# EAGLE design Clock (EAGLE 7.2.0)
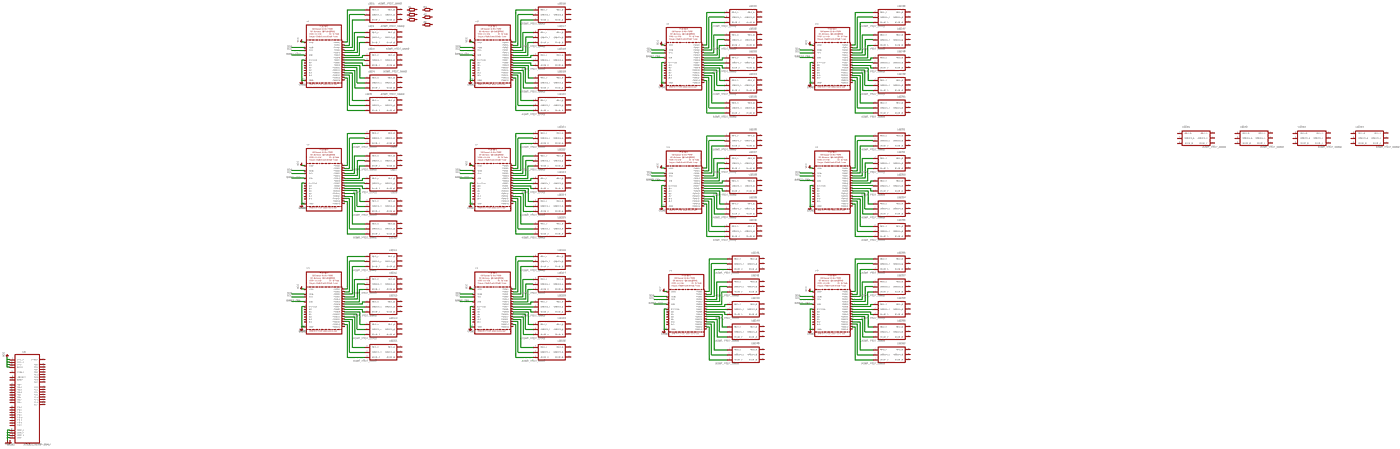
[diagram p0: schematic, sheet 1, overview]
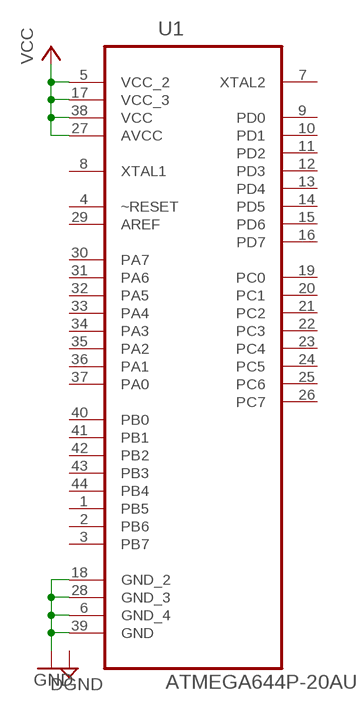
[diagram p1: schematic, sheet 1, part 1 of 4]
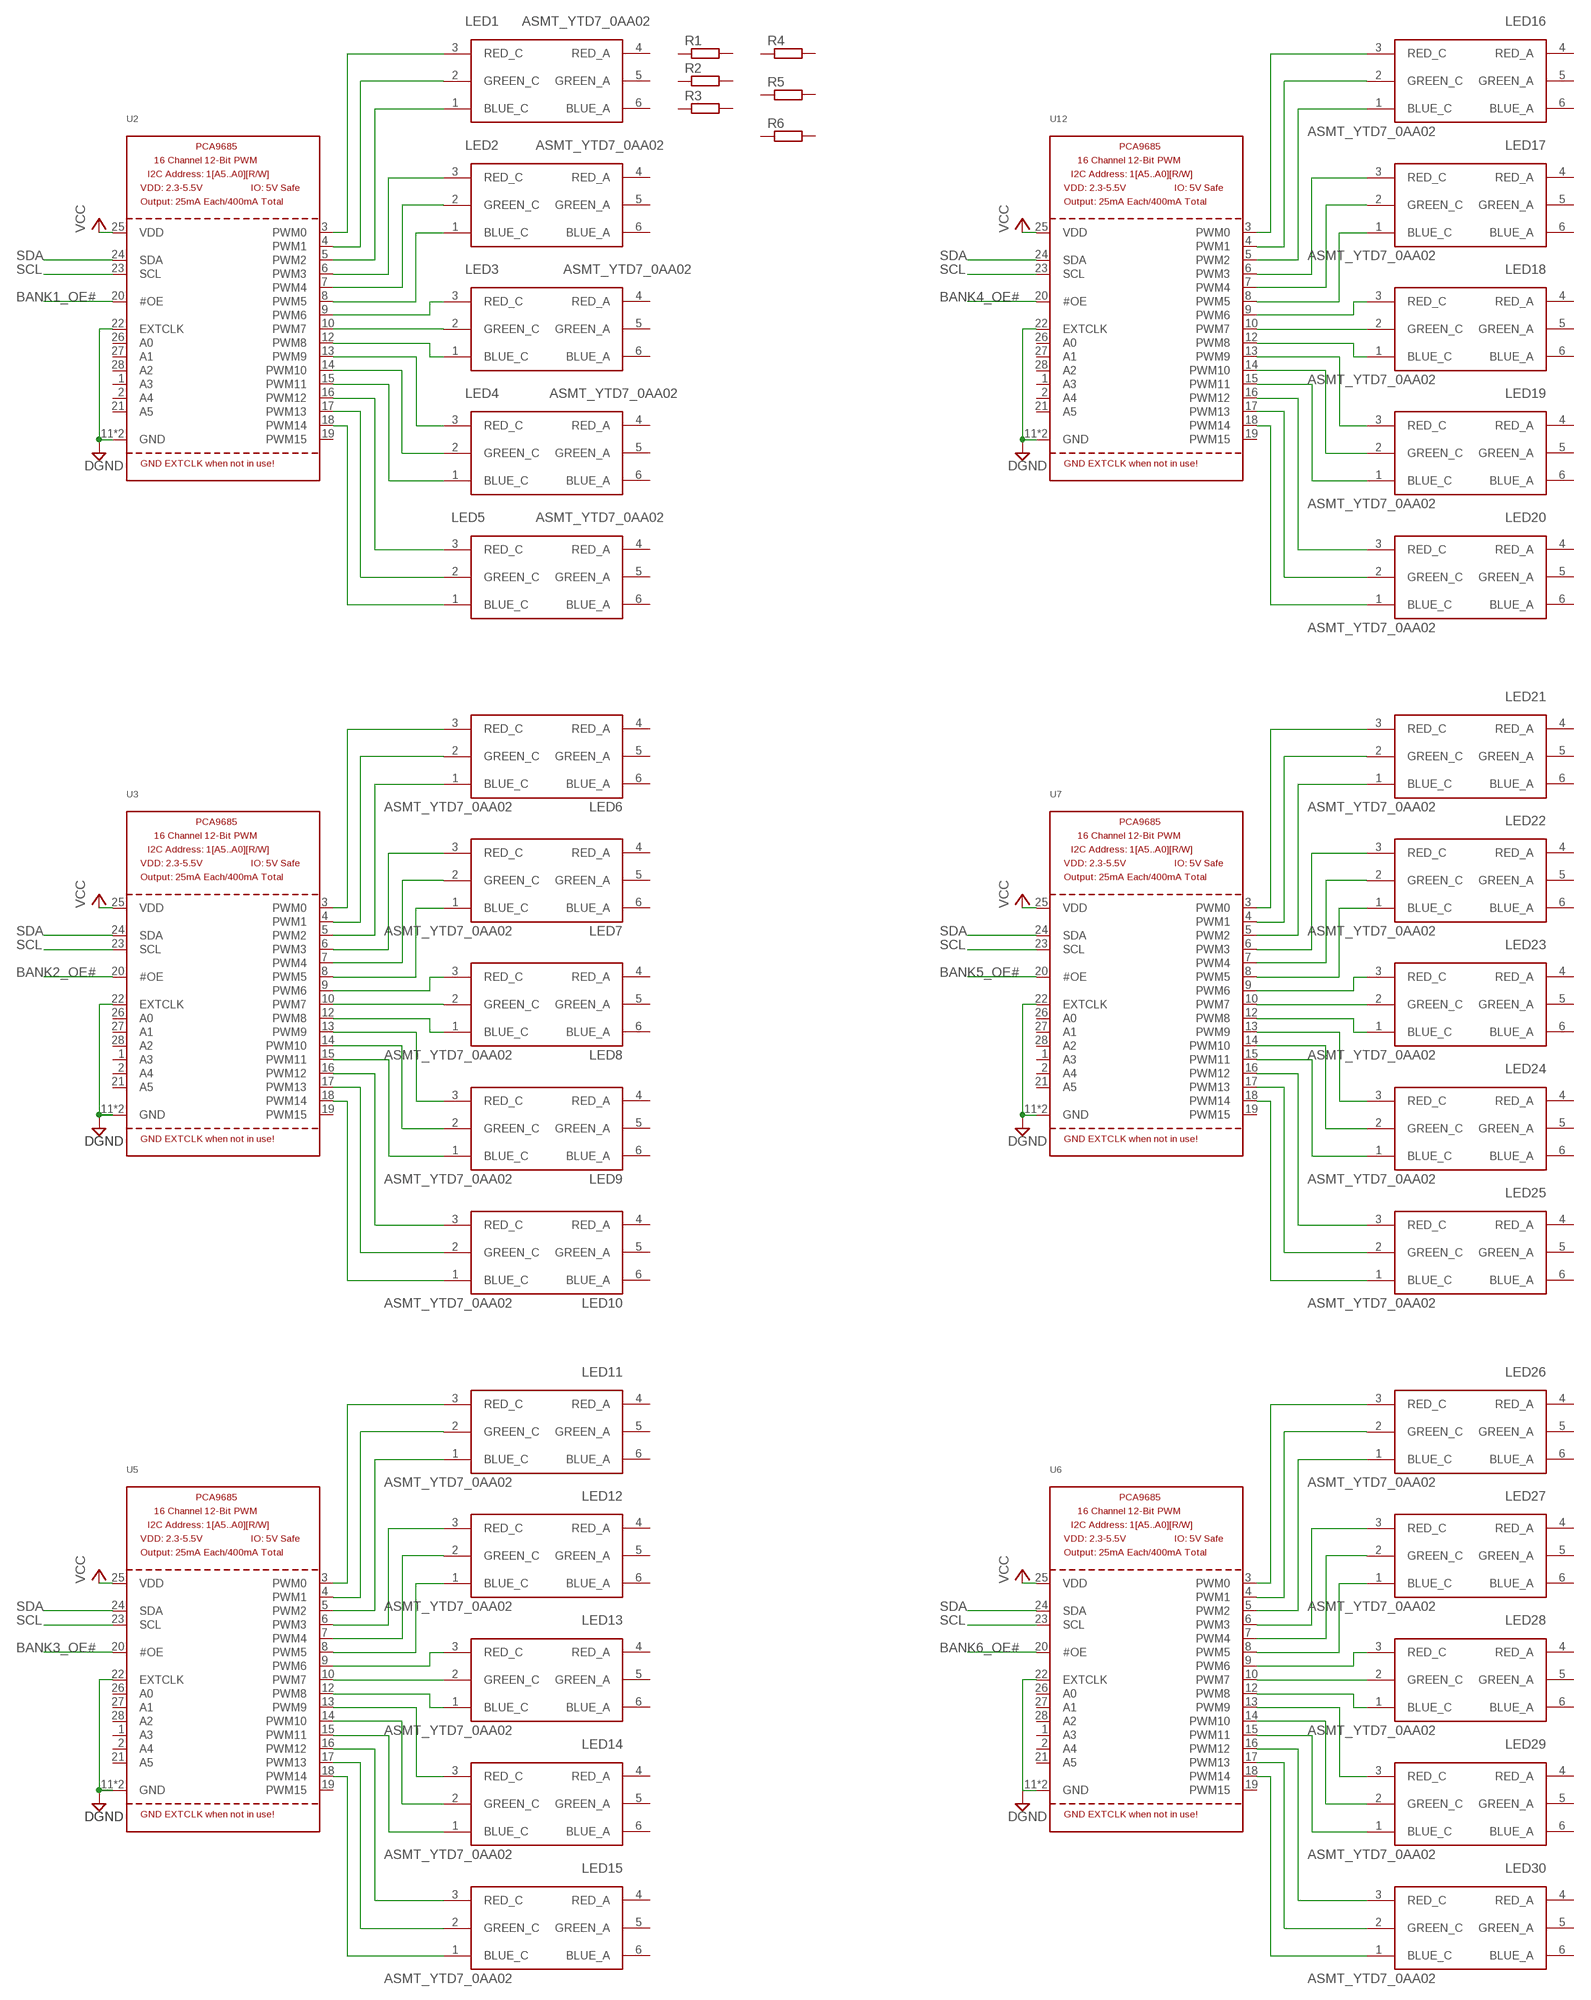
[diagram p2: schematic, sheet 1, part 2 of 4]
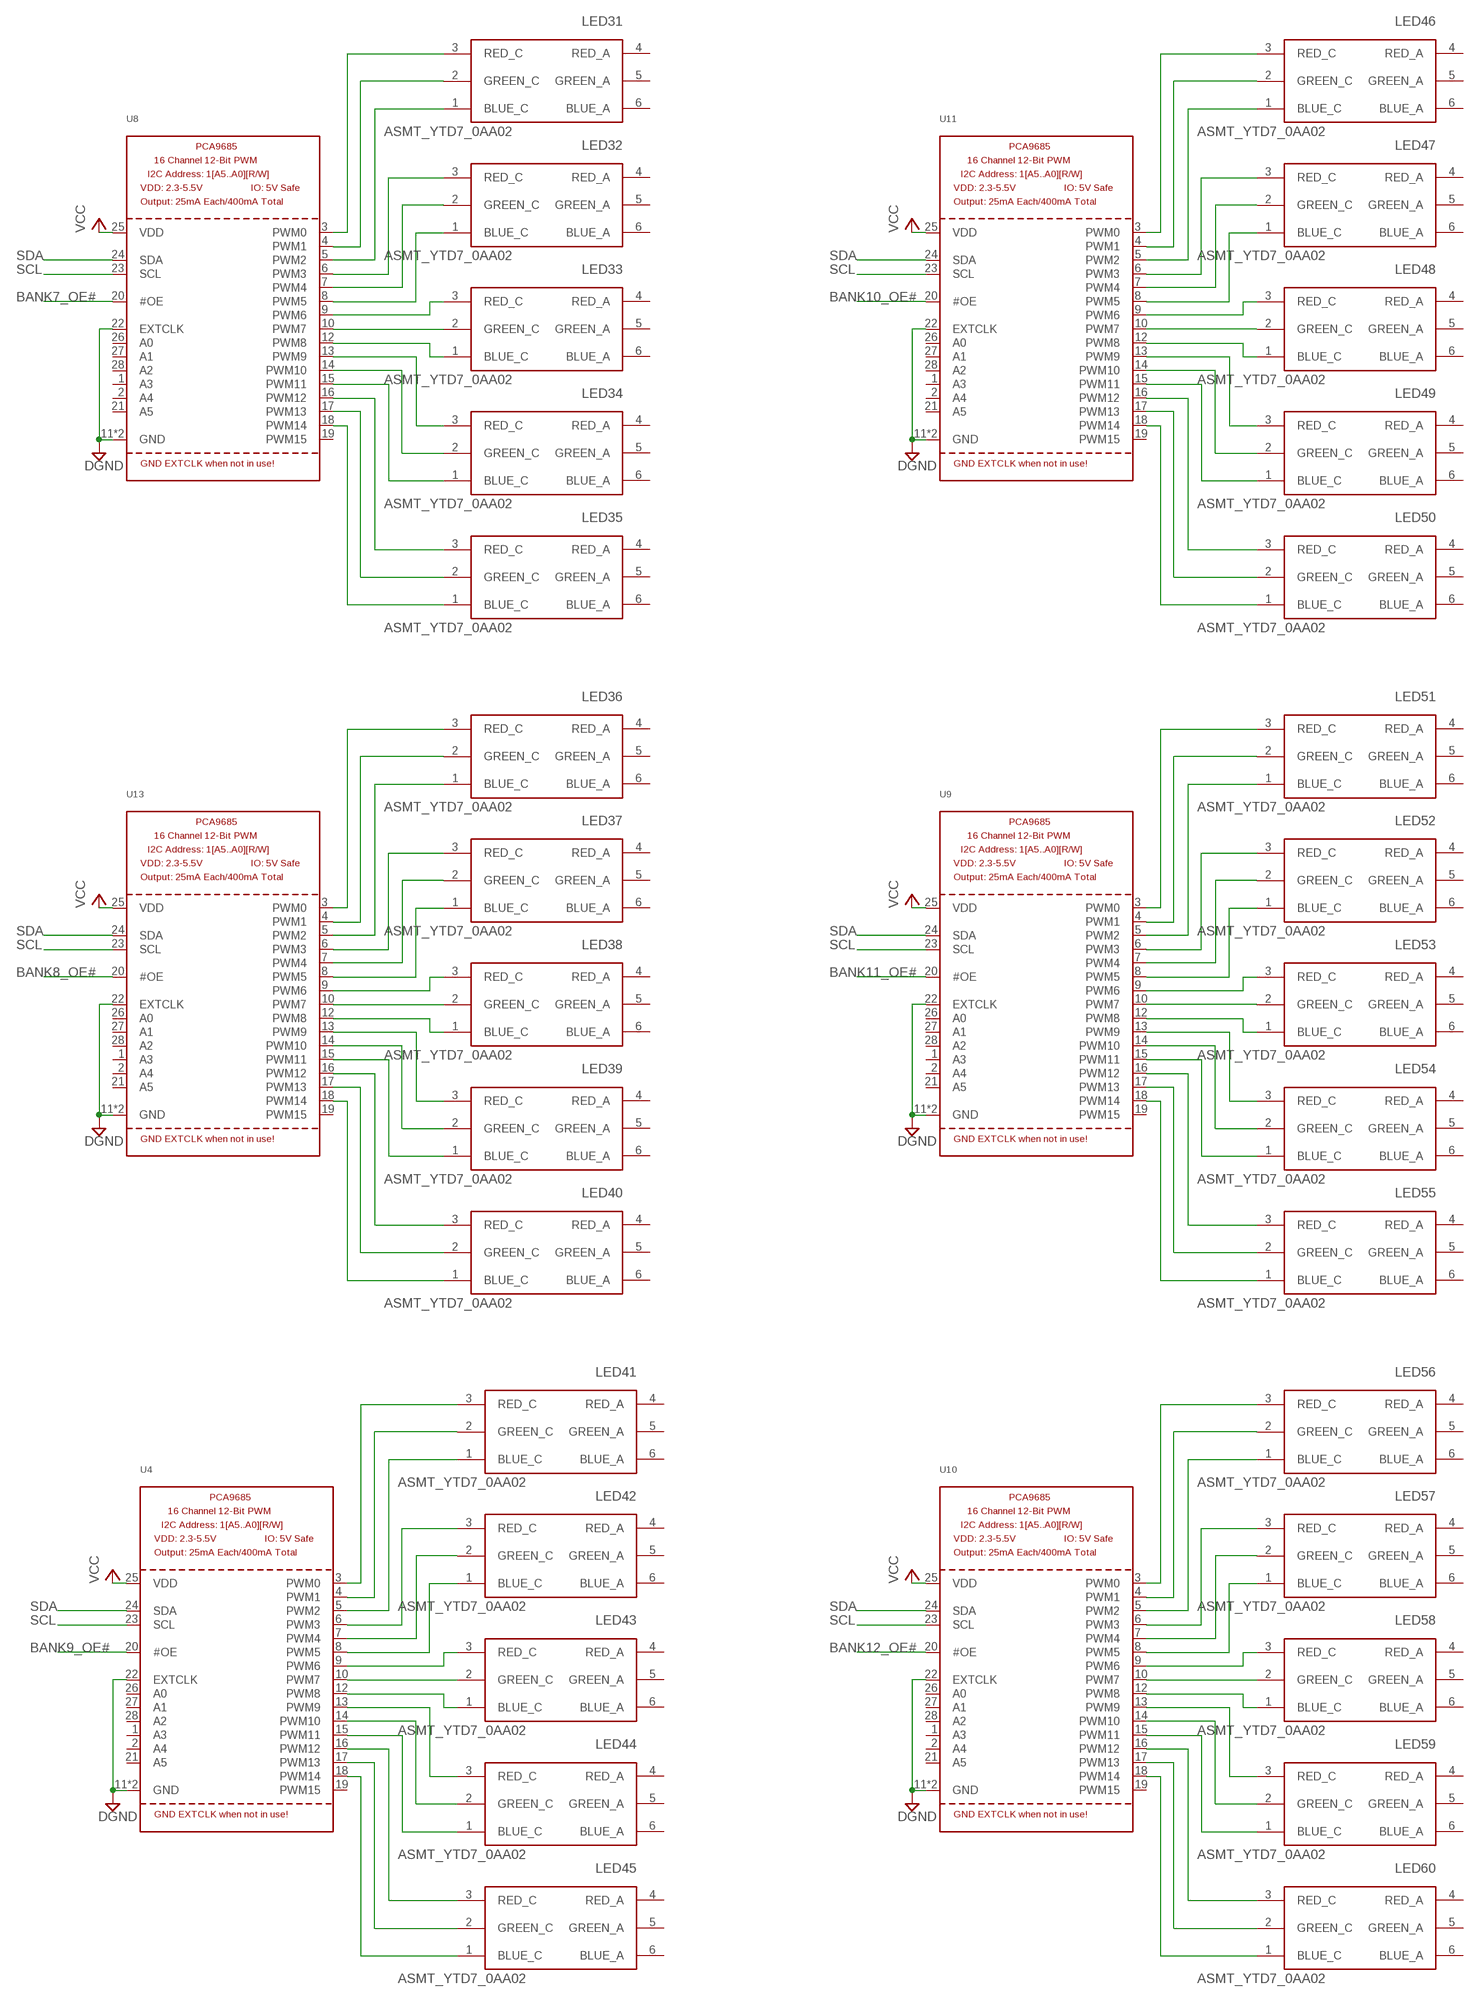
[diagram p3: schematic, sheet 1, part 3 of 4]
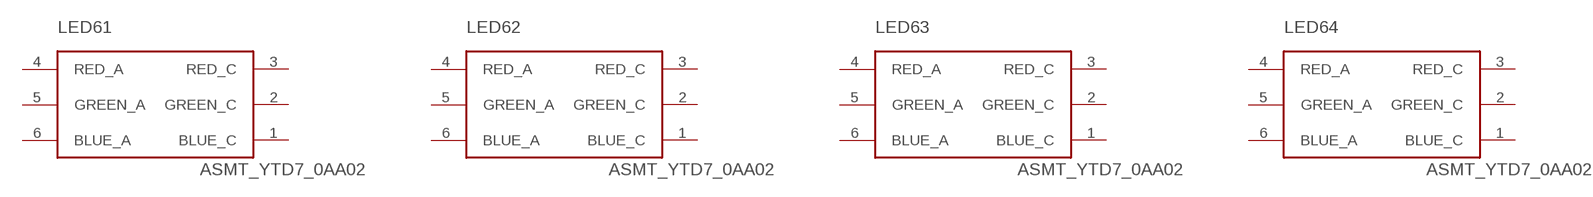
[diagram p4: schematic, sheet 1, part 4 of 4]

## Parts
LED1  ASMT_YTD7_0AA02  [ASMT-YTD7-0AA02]
LED2  ASMT_YTD7_0AA02  [ASMT-YTD7-0AA02]
LED3  ASMT_YTD7_0AA02  [ASMT-YTD7-0AA02]
LED4  ASMT_YTD7_0AA02  [ASMT-YTD7-0AA02]
LED5  ASMT_YTD7_0AA02  [ASMT-YTD7-0AA02]
LED6  ASMT_YTD7_0AA02  [ASMT-YTD7-0AA02]
LED7  ASMT_YTD7_0AA02  [ASMT-YTD7-0AA02]
LED8  ASMT_YTD7_0AA02  [ASMT-YTD7-0AA02]
LED9  ASMT_YTD7_0AA02  [ASMT-YTD7-0AA02]
LED10  ASMT_YTD7_0AA02  [ASMT-YTD7-0AA02]
LED11  ASMT_YTD7_0AA02  [ASMT-YTD7-0AA02]
LED12  ASMT_YTD7_0AA02  [ASMT-YTD7-0AA02]
LED13  ASMT_YTD7_0AA02  [ASMT-YTD7-0AA02]
LED14  ASMT_YTD7_0AA02  [ASMT-YTD7-0AA02]
LED15  ASMT_YTD7_0AA02  [ASMT-YTD7-0AA02]
LED16  ASMT_YTD7_0AA02  [ASMT-YTD7-0AA02]
LED17  ASMT_YTD7_0AA02  [ASMT-YTD7-0AA02]
LED18  ASMT_YTD7_0AA02  [ASMT-YTD7-0AA02]
LED19  ASMT_YTD7_0AA02  [ASMT-YTD7-0AA02]
LED20  ASMT_YTD7_0AA02  [ASMT-YTD7-0AA02]
LED21  ASMT_YTD7_0AA02  [ASMT-YTD7-0AA02]
LED22  ASMT_YTD7_0AA02  [ASMT-YTD7-0AA02]
LED23  ASMT_YTD7_0AA02  [ASMT-YTD7-0AA02]
LED24  ASMT_YTD7_0AA02  [ASMT-YTD7-0AA02]
LED25  ASMT_YTD7_0AA02  [ASMT-YTD7-0AA02]
LED26  ASMT_YTD7_0AA02  [ASMT-YTD7-0AA02]
LED27  ASMT_YTD7_0AA02  [ASMT-YTD7-0AA02]
LED28  ASMT_YTD7_0AA02  [ASMT-YTD7-0AA02]
LED29  ASMT_YTD7_0AA02  [ASMT-YTD7-0AA02]
LED30  ASMT_YTD7_0AA02  [ASMT-YTD7-0AA02]
LED31  ASMT_YTD7_0AA02  [ASMT-YTD7-0AA02]
LED32  ASMT_YTD7_0AA02  [ASMT-YTD7-0AA02]
LED33  ASMT_YTD7_0AA02  [ASMT-YTD7-0AA02]
LED34  ASMT_YTD7_0AA02  [ASMT-YTD7-0AA02]
LED35  ASMT_YTD7_0AA02  [ASMT-YTD7-0AA02]
LED36  ASMT_YTD7_0AA02  [ASMT-YTD7-0AA02]
LED37  ASMT_YTD7_0AA02  [ASMT-YTD7-0AA02]
LED38  ASMT_YTD7_0AA02  [ASMT-YTD7-0AA02]
LED39  ASMT_YTD7_0AA02  [ASMT-YTD7-0AA02]
LED40  ASMT_YTD7_0AA02  [ASMT-YTD7-0AA02]
LED41  ASMT_YTD7_0AA02  [ASMT-YTD7-0AA02]
LED42  ASMT_YTD7_0AA02  [ASMT-YTD7-0AA02]
LED43  ASMT_YTD7_0AA02  [ASMT-YTD7-0AA02]
LED44  ASMT_YTD7_0AA02  [ASMT-YTD7-0AA02]
LED45  ASMT_YTD7_0AA02  [ASMT-YTD7-0AA02]
LED46  ASMT_YTD7_0AA02  [ASMT-YTD7-0AA02]
LED47  ASMT_YTD7_0AA02  [ASMT-YTD7-0AA02]
LED48  ASMT_YTD7_0AA02  [ASMT-YTD7-0AA02]
LED49  ASMT_YTD7_0AA02  [ASMT-YTD7-0AA02]
LED50  ASMT_YTD7_0AA02  [ASMT-YTD7-0AA02]
LED51  ASMT_YTD7_0AA02  [ASMT-YTD7-0AA02]
LED52  ASMT_YTD7_0AA02  [ASMT-YTD7-0AA02]
LED53  ASMT_YTD7_0AA02  [ASMT-YTD7-0AA02]
LED54  ASMT_YTD7_0AA02  [ASMT-YTD7-0AA02]
LED55  ASMT_YTD7_0AA02  [ASMT-YTD7-0AA02]
LED56  ASMT_YTD7_0AA02  [ASMT-YTD7-0AA02]
LED57  ASMT_YTD7_0AA02  [ASMT-YTD7-0AA02]
LED58  ASMT_YTD7_0AA02  [ASMT-YTD7-0AA02]
LED59  ASMT_YTD7_0AA02  [ASMT-YTD7-0AA02]
LED60  ASMT_YTD7_0AA02  [ASMT-YTD7-0AA02]
LED61  ASMT_YTD7_0AA02  [ASMT-YTD7-0AA02]
LED62  ASMT_YTD7_0AA02  [ASMT-YTD7-0AA02]
LED63  ASMT_YTD7_0AA02  [ASMT-YTD7-0AA02]
LED64  ASMT_YTD7_0AA02  [ASMT-YTD7-0AA02]
R1  R0603  [R0603]
R2  R0603  [R0603]
R3  R0603  [R0603]
R4  R-EU_R0402  [R0402]
R5  R-EU_R0402  [R0402]
R6  R-EU_R0402  [R0402]
U1  ATMEGA644P-20AU  [QFP80P1200X1200X120-44N]
U2  PCA9685QFN28  [QFN28]
U3  PCA9685QFN28  [QFN28]
U4  PCA9685QFN28  [QFN28]
U5  PCA9685QFN28  [QFN28]
U6  PCA9685QFN28  [QFN28]
U7  PCA9685QFN28  [QFN28]
U8  PCA9685QFN28  [QFN28]
U9  PCA9685QFN28  [QFN28]
U10  PCA9685QFN28  [QFN28]
U11  PCA9685QFN28  [QFN28]
U12  PCA9685QFN28  [QFN28]
U13  PCA9685QFN28  [QFN28]

## Nets
BANK1_OE#: U2.20(#OE)
BANK2_OE#: U3.20(#OE)
BANK3_OE#: U5.20(#OE)
BANK4_OE#: U12.20(#OE)
BANK5_OE#: U7.20(#OE)
BANK6_OE#: U6.20(#OE)
BANK7_OE#: U8.20(#OE)
BANK8_OE#: U13.20(#OE)
BANK9_OE#: U4.20(#OE)
BANK10_OE#: U11.20(#OE)
BANK11_OE#: U9.20(#OE)
BANK12_OE#: U10.20(#OE)
DGND: U2.11(GND) U2.22(EXTCLK) U2.M(GND) U3.11(GND) U3.22(EXTCLK) U3.M(GND) U4.11(GND) U4.22(EXTCLK) U4.M(GND) U5.11(GND) U5.22(EXTCLK) U5.M(GND) U6.11(GND) U6.M(GND) U7.11(GND) U7.22(EXTCLK) U7.M(GND) U8.11(GND) U8.22(EXTCLK) U8.M(GND) U9.11(GND) U9.22(EXTCLK) U9.M(GND) U10.11(GND) U10.22(EXTCLK) U10.M(GND) U11.11(GND) U11.22(EXTCLK) U11.M(GND) U12.11(GND) U12.22(EXTCLK) U12.M(GND) U13.11(GND) U13.22(EXTCLK) U13.M(GND)
GND: U1.6(GND_4) U1.18(GND_2) U1.28(GND_3) U1.39(GND)
N$2: LED8.3(RED_C) U3.9(PWM6)
N$6: LED3.3(RED_C) U2.9(PWM6)
N$7: LED3.1(BLUE_C) U2.12(PWM8)
N$8: LED2.1(BLUE_C) U2.8(PWM5)
N$9: LED2.2(GREEN_C) U2.7(PWM4)
N$10: LED2.3(RED_C) U2.6(PWM3)
N$11: LED1.1(BLUE_C) U2.5(PWM2)
N$12: LED1.2(GREEN_C) U2.4(PWM1)
N$13: LED1.3(RED_C) U2.3(PWM0)
N$14: LED4.3(RED_C) U2.13(PWM9)
N$15: LED4.2(GREEN_C) U2.14(PWM10)
N$16: LED4.1(BLUE_C) U2.15(PWM11)
N$17: LED5.3(RED_C) U2.16(PWM12)
N$18: LED5.2(GREEN_C) U2.17(PWM13)
N$19: LED5.1(BLUE_C) U2.18(PWM14)
N$20: LED3.2(GREEN_C) U2.10(PWM7)
N$21: LED8.1(BLUE_C) U3.12(PWM8)
N$22: LED7.1(BLUE_C) U3.8(PWM5)
N$23: LED7.2(GREEN_C) U3.7(PWM4)
N$24: LED7.3(RED_C) U3.6(PWM3)
N$25: LED6.1(BLUE_C) U3.5(PWM2)
N$26: LED6.2(GREEN_C) U3.4(PWM1)
N$27: LED6.3(RED_C) U3.3(PWM0)
N$28: LED9.3(RED_C) U3.13(PWM9)
N$29: LED9.2(GREEN_C) U3.14(PWM10)
N$30: LED9.1(BLUE_C) U3.15(PWM11)
N$31: LED10.3(RED_C) U3.16(PWM12)
N$32: LED10.2(GREEN_C) U3.17(PWM13)
N$33: LED10.1(BLUE_C) U3.18(PWM14)
N$34: LED13.3(RED_C) U5.9(PWM6)
N$35: LED13.1(BLUE_C) U5.12(PWM8)
N$36: LED12.1(BLUE_C) U5.8(PWM5)
N$37: LED12.2(GREEN_C) U5.7(PWM4)
N$38: LED12.3(RED_C) U5.6(PWM3)
N$39: LED11.1(BLUE_C) U5.5(PWM2)
N$40: LED11.2(GREEN_C) U5.4(PWM1)
N$41: LED11.3(RED_C) U5.3(PWM0)
N$42: LED14.3(RED_C) U5.13(PWM9)
N$43: LED14.2(GREEN_C) U5.14(PWM10)
N$44: LED14.1(BLUE_C) U5.15(PWM11)
N$45: LED15.3(RED_C) U5.16(PWM12)
N$46: LED15.2(GREEN_C) U5.17(PWM13)
N$47: LED15.1(BLUE_C) U5.18(PWM14)
N$48: LED18.3(RED_C) U12.9(PWM6)
N$49: LED18.1(BLUE_C) U12.12(PWM8)
N$50: LED17.1(BLUE_C) U12.8(PWM5)
N$51: LED17.2(GREEN_C) U12.7(PWM4)
N$52: LED17.3(RED_C) U12.6(PWM3)
N$53: LED16.1(BLUE_C) U12.5(PWM2)
N$54: LED16.2(GREEN_C) U12.4(PWM1)
N$55: LED16.3(RED_C) U12.3(PWM0)
N$56: LED19.3(RED_C) U12.13(PWM9)
N$57: LED19.2(GREEN_C) U12.14(PWM10)
N$58: LED19.1(BLUE_C) U12.15(PWM11)
N$59: LED20.3(RED_C) U12.16(PWM12)
N$60: LED20.2(GREEN_C) U12.17(PWM13)
N$61: LED20.1(BLUE_C) U12.18(PWM14)
N$62: LED23.3(RED_C) U7.9(PWM6)
N$63: LED23.1(BLUE_C) U7.12(PWM8)
N$64: LED22.1(BLUE_C) U7.8(PWM5)
N$65: LED22.2(GREEN_C) U7.7(PWM4)
N$66: LED22.3(RED_C) U7.6(PWM3)
N$67: LED21.1(BLUE_C) U7.5(PWM2)
N$68: LED21.2(GREEN_C) U7.4(PWM1)
N$69: LED21.3(RED_C) U7.3(PWM0)
N$70: LED24.3(RED_C) U7.13(PWM9)
N$71: LED24.2(GREEN_C) U7.14(PWM10)
N$72: LED24.1(BLUE_C) U7.15(PWM11)
N$73: LED25.3(RED_C) U7.16(PWM12)
N$74: LED25.2(GREEN_C) U7.17(PWM13)
N$75: LED25.1(BLUE_C) U7.18(PWM14)
N$76: LED28.3(RED_C) U6.9(PWM6)
N$77: LED28.1(BLUE_C) U6.12(PWM8)
N$78: LED27.1(BLUE_C) U6.8(PWM5)
N$79: LED27.2(GREEN_C) U6.7(PWM4)
N$80: LED27.3(RED_C) U6.6(PWM3)
N$81: LED26.1(BLUE_C) U6.5(PWM2)
N$82: LED26.2(GREEN_C) U6.4(PWM1)
N$83: LED26.3(RED_C) U6.3(PWM0)
N$84: LED29.3(RED_C) U6.13(PWM9)
N$85: LED29.2(GREEN_C) U6.14(PWM10)
N$86: LED29.1(BLUE_C) U6.15(PWM11)
N$87: LED30.3(RED_C) U6.16(PWM12)
N$88: LED30.2(GREEN_C) U6.17(PWM13)
N$89: LED30.1(BLUE_C) U6.18(PWM14)
N$90: LED43.3(RED_C) U4.9(PWM6)
N$91: LED43.1(BLUE_C) U4.12(PWM8)
N$92: LED42.1(BLUE_C) U4.8(PWM5)
N$93: LED42.2(GREEN_C) U4.7(PWM4)
N$94: LED42.3(RED_C) U4.6(PWM3)
N$95: LED41.1(BLUE_C) U4.5(PWM2)
N$96: LED41.2(GREEN_C) U4.4(PWM1)
N$97: LED41.3(RED_C) U4.3(PWM0)
N$98: LED44.3(RED_C) U4.13(PWM9)
N$99: LED44.2(GREEN_C) U4.14(PWM10)
N$100: LED44.1(BLUE_C) U4.15(PWM11)
N$101: LED45.3(RED_C) U4.16(PWM12)
N$102: LED45.2(GREEN_C) U4.17(PWM13)
N$103: LED45.1(BLUE_C) U4.18(PWM14)
N$104: LED38.3(RED_C) U13.9(PWM6)
N$105: LED38.1(BLUE_C) U13.12(PWM8)
N$106: LED37.1(BLUE_C) U13.8(PWM5)
N$107: LED37.2(GREEN_C) U13.7(PWM4)
N$108: LED37.3(RED_C) U13.6(PWM3)
N$109: LED36.1(BLUE_C) U13.5(PWM2)
N$110: LED36.2(GREEN_C) U13.4(PWM1)
N$111: LED36.3(RED_C) U13.3(PWM0)
N$112: LED39.3(RED_C) U13.13(PWM9)
N$113: LED39.2(GREEN_C) U13.14(PWM10)
N$114: LED39.1(BLUE_C) U13.15(PWM11)
N$115: LED40.3(RED_C) U13.16(PWM12)
N$116: LED40.2(GREEN_C) U13.17(PWM13)
N$117: LED40.1(BLUE_C) U13.18(PWM14)
N$118: LED33.3(RED_C) U8.9(PWM6)
N$119: LED33.1(BLUE_C) U8.12(PWM8)
N$120: LED32.1(BLUE_C) U8.8(PWM5)
N$121: LED32.2(GREEN_C) U8.7(PWM4)
N$122: LED32.3(RED_C) U8.6(PWM3)
N$123: LED31.1(BLUE_C) U8.5(PWM2)
N$124: LED31.2(GREEN_C) U8.4(PWM1)
N$125: LED31.3(RED_C) U8.3(PWM0)
N$126: LED34.3(RED_C) U8.13(PWM9)
N$127: LED34.2(GREEN_C) U8.14(PWM10)
N$128: LED34.1(BLUE_C) U8.15(PWM11)
N$129: LED35.3(RED_C) U8.16(PWM12)
N$130: LED35.2(GREEN_C) U8.17(PWM13)
N$131: LED35.1(BLUE_C) U8.18(PWM14)
N$132: LED48.3(RED_C) U11.9(PWM6)
N$133: LED48.1(BLUE_C) U11.12(PWM8)
N$134: LED47.1(BLUE_C) U11.8(PWM5)
N$135: LED47.2(GREEN_C) U11.7(PWM4)
N$136: LED47.3(RED_C) U11.6(PWM3)
N$137: LED46.1(BLUE_C) U11.5(PWM2)
N$138: LED46.2(GREEN_C) U11.4(PWM1)
N$139: LED46.3(RED_C) U11.3(PWM0)
N$140: LED49.3(RED_C) U11.13(PWM9)
N$141: LED49.2(GREEN_C) U11.14(PWM10)
N$142: LED49.1(BLUE_C) U11.15(PWM11)
N$143: LED50.3(RED_C) U11.16(PWM12)
N$144: LED50.2(GREEN_C) U11.17(PWM13)
N$145: LED50.1(BLUE_C) U11.18(PWM14)
N$146: LED53.3(RED_C) U9.9(PWM6)
N$147: LED53.1(BLUE_C) U9.12(PWM8)
N$148: LED52.1(BLUE_C) U9.8(PWM5)
N$149: LED52.2(GREEN_C) U9.7(PWM4)
N$150: LED52.3(RED_C) U9.6(PWM3)
N$151: LED51.1(BLUE_C) U9.5(PWM2)
N$152: LED51.2(GREEN_C) U9.4(PWM1)
N$153: LED51.3(RED_C) U9.3(PWM0)
N$154: LED54.3(RED_C) U9.13(PWM9)
N$155: LED54.2(GREEN_C) U9.14(PWM10)
N$156: LED54.1(BLUE_C) U9.15(PWM11)
N$157: LED55.3(RED_C) U9.16(PWM12)
N$158: LED55.2(GREEN_C) U9.17(PWM13)
N$159: LED55.1(BLUE_C) U9.18(PWM14)
N$160: LED58.3(RED_C) U10.9(PWM6)
N$161: LED58.1(BLUE_C) U10.12(PWM8)
N$162: LED57.1(BLUE_C) U10.8(PWM5)
N$163: LED57.2(GREEN_C) U10.7(PWM4)
N$164: LED57.3(RED_C) U10.6(PWM3)
N$165: LED56.1(BLUE_C) U10.5(PWM2)
N$166: LED56.2(GREEN_C) U10.4(PWM1)
N$167: LED56.3(RED_C) U10.3(PWM0)
N$168: LED59.3(RED_C) U10.13(PWM9)
N$169: LED59.2(GREEN_C) U10.14(PWM10)
N$170: LED59.1(BLUE_C) U10.15(PWM11)
N$171: LED60.3(RED_C) U10.16(PWM12)
N$172: LED60.2(GREEN_C) U10.17(PWM13)
N$173: LED60.1(BLUE_C) U10.18(PWM14)
N$174: LED48.2(GREEN_C) U11.10(PWM7)
N$175: LED53.2(GREEN_C) U9.10(PWM7)
N$176: LED58.2(GREEN_C) U10.10(PWM7)
N$177: LED43.2(GREEN_C) U4.10(PWM7)
N$178: LED38.2(GREEN_C) U13.10(PWM7)
N$179: LED33.2(GREEN_C) U8.10(PWM7)
N$180: LED18.2(GREEN_C) U12.10(PWM7)
N$181: LED23.2(GREEN_C) U7.10(PWM7)
N$182: LED28.2(GREEN_C) U6.10(PWM7)
N$183: LED13.2(GREEN_C) U5.10(PWM7)
N$184: LED8.2(GREEN_C) U3.10(PWM7)
N$185: U6.22(EXTCLK)
SCL: U2.23(SCL) U3.23(SCL) U4.23(SCL) U5.23(SCL) U6.23(SCL) U7.23(SCL) U8.23(SCL) U9.23(SCL) U10.23(SCL) U11.23(SCL) U12.23(SCL) U13.23(SCL)
SDA: U2.24(SDA) U3.24(SDA) U4.24(SDA) U5.24(SDA) U6.24(SDA) U7.24(SDA) U8.24(SDA) U9.24(SDA) U10.24(SDA) U11.24(SDA) U12.24(SDA) U13.24(SDA)
VCC: U1.5(VCC_2) U1.17(VCC_3) U1.27(AVCC) U1.38(VCC) U2.25(VDD) U3.25(VDD) U4.25(VDD) U5.25(VDD) U6.25(VDD) U7.25(VDD) U8.25(VDD) U9.25(VDD) U10.25(VDD) U11.25(VDD) U12.25(VDD) U13.25(VDD)
Unconnected: LED1.4(RED_A) LED1.5(GREEN_A) LED1.6(BLUE_A) LED2.4(RED_A) LED2.5(GREEN_A) LED2.6(BLUE_A) LED3.4(RED_A) LED3.5(GREEN_A) LED3.6(BLUE_A) LED4.4(RED_A) LED4.5(GREEN_A) LED4.6(BLUE_A) LED5.4(RED_A) LED5.5(GREEN_A) LED5.6(BLUE_A) LED6.4(RED_A) LED6.5(GREEN_A) LED6.6(BLUE_A) LED7.4(RED_A) LED7.5(GREEN_A) LED7.6(BLUE_A) LED8.4(RED_A) LED8.5(GREEN_A) LED8.6(BLUE_A) LED9.4(RED_A) LED9.5(GREEN_A) LED9.6(BLUE_A) LED10.4(RED_A) LED10.5(GREEN_A) LED10.6(BLUE_A) LED11.4(RED_A) LED11.5(GREEN_A) LED11.6(BLUE_A) LED12.4(RED_A) LED12.5(GREEN_A) LED12.6(BLUE_A) LED13.4(RED_A) LED13.5(GREEN_A) LED13.6(BLUE_A) LED14.4(RED_A) LED14.5(GREEN_A) LED14.6(BLUE_A) LED15.4(RED_A) LED15.5(GREEN_A) LED15.6(BLUE_A) LED16.4(RED_A) LED16.5(GREEN_A) LED16.6(BLUE_A) LED17.4(RED_A) LED17.5(GREEN_A) LED17.6(BLUE_A) LED18.4(RED_A) LED18.5(GREEN_A) LED18.6(BLUE_A) LED19.4(RED_A) LED19.5(GREEN_A) LED19.6(BLUE_A) LED20.4(RED_A) LED20.5(GREEN_A) LED20.6(BLUE_A) LED21.4(RED_A) LED21.5(GREEN_A) LED21.6(BLUE_A) LED22.4(RED_A) LED22.5(GREEN_A) LED22.6(BLUE_A) LED23.4(RED_A) LED23.5(GREEN_A) LED23.6(BLUE_A) LED24.4(RED_A) LED24.5(GREEN_A) LED24.6(BLUE_A) LED25.4(RED_A) LED25.5(GREEN_A) LED25.6(BLUE_A) LED26.4(RED_A) LED26.5(GREEN_A) LED26.6(BLUE_A) LED27.4(RED_A) LED27.5(GREEN_A) LED27.6(BLUE_A) LED28.4(RED_A) LED28.5(GREEN_A) LED28.6(BLUE_A) LED29.4(RED_A) LED29.5(GREEN_A) LED29.6(BLUE_A) LED30.4(RED_A) LED30.5(GREEN_A) LED30.6(BLUE_A) LED31.4(RED_A) LED31.5(GREEN_A) LED31.6(BLUE_A) LED32.4(RED_A) LED32.5(GREEN_A) LED32.6(BLUE_A) LED33.4(RED_A) LED33.5(GREEN_A) LED33.6(BLUE_A) LED34.4(RED_A) LED34.5(GREEN_A) LED34.6(BLUE_A) LED35.4(RED_A) LED35.5(GREEN_A) LED35.6(BLUE_A) LED36.4(RED_A) LED36.5(GREEN_A) LED36.6(BLUE_A) LED37.4(RED_A) LED37.5(GREEN_A) LED37.6(BLUE_A) LED38.4(RED_A) LED38.5(GREEN_A) LED38.6(BLUE_A) LED39.4(RED_A) LED39.5(GREEN_A) LED39.6(BLUE_A) LED40.4(RED_A) LED40.5(GREEN_A) LED40.6(BLUE_A) LED41.4(RED_A) LED41.5(GREEN_A) LED41.6(BLUE_A) LED42.4(RED_A) LED42.5(GREEN_A) LED42.6(BLUE_A) LED43.4(RED_A) LED43.5(GREEN_A) LED43.6(BLUE_A) LED44.4(RED_A) LED44.5(GREEN_A) LED44.6(BLUE_A) LED45.4(RED_A) LED45.5(GREEN_A) LED45.6(BLUE_A) LED46.4(RED_A) LED46.5(GREEN_A) LED46.6(BLUE_A) LED47.4(RED_A) LED47.5(GREEN_A) LED47.6(BLUE_A) LED48.4(RED_A) LED48.5(GREEN_A) LED48.6(BLUE_A) LED49.4(RED_A) LED49.5(GREEN_A) LED49.6(BLUE_A) LED50.4(RED_A) LED50.5(GREEN_A) LED50.6(BLUE_A) LED51.4(RED_A) LED51.5(GREEN_A) LED51.6(BLUE_A) LED52.4(RED_A) LED52.5(GREEN_A) LED52.6(BLUE_A) LED53.4(RED_A) LED53.5(GREEN_A) LED53.6(BLUE_A) LED54.4(RED_A) LED54.5(GREEN_A) LED54.6(BLUE_A) LED55.4(RED_A) LED55.5(GREEN_A) LED55.6(BLUE_A) LED56.4(RED_A) LED56.5(GREEN_A) LED56.6(BLUE_A) LED57.4(RED_A) LED57.5(GREEN_A) LED57.6(BLUE_A) LED58.4(RED_A) LED58.5(GREEN_A) LED58.6(BLUE_A) LED59.4(RED_A) LED59.5(GREEN_A) LED59.6(BLUE_A) LED60.4(RED_A) LED60.5(GREEN_A) LED60.6(BLUE_A) LED61.1(BLUE_C) LED61.2(GREEN_C) LED61.3(RED_C) LED61.4(RED_A) LED61.5(GREEN_A) LED61.6(BLUE_A) LED62.1(BLUE_C) LED62.2(GREEN_C) LED62.3(RED_C) LED62.4(RED_A) LED62.5(GREEN_A) LED62.6(BLUE_A) LED63.1(BLUE_C) LED63.2(GREEN_C) LED63.3(RED_C) LED63.4(RED_A) LED63.5(GREEN_A) LED63.6(BLUE_A) LED64.1(BLUE_C) LED64.2(GREEN_C) LED64.3(RED_C) LED64.4(RED_A) LED64.5(GREEN_A) LED64.6(BLUE_A) R1.1 R1.2 R2.1 R2.2 R3.1 R3.2 R4.1 R4.2 R5.1 R5.2 R6.1 R6.2 U1.1(PB5) U1.2(PB6) U1.3(PB7) U1.4(~RESET) U1.7(XTAL2) U1.8(XTAL1) U1.9(PD0) U1.10(PD1) U1.11(PD2) U1.12(PD3) U1.13(PD4) U1.14(PD5) U1.15(PD6) U1.16(PD7) U1.19(PC0) U1.20(PC1) U1.21(PC2) U1.22(PC3) U1.23(PC4) U1.24(PC5) U1.25(PC6) U1.26(PC7) U1.29(AREF) U1.30(PA7) U1.31(PA6) U1.32(PA5) U1.33(PA4) U1.34(PA3) U1.35(PA2) U1.36(PA1) U1.37(PA0) U1.40(PB0) U1.41(PB1) U1.42(PB2) U1.43(PB3) U1.44(PB4) U2.1(A3) U2.2(A4) U2.19(PWM15) U2.21(A5) U2.26(A0) U2.27(A1) U2.28(A2) U3.1(A3) U3.2(A4) U3.19(PWM15) U3.21(A5) U3.26(A0) U3.27(A1) U3.28(A2) U4.1(A3) U4.2(A4) U4.19(PWM15) U4.21(A5) U4.26(A0) U4.27(A1) U4.28(A2) U5.1(A3) U5.2(A4) U5.19(PWM15) U5.21(A5) U5.26(A0) U5.27(A1) U5.28(A2) U6.1(A3) U6.2(A4) U6.19(PWM15) U6.21(A5) U6.26(A0) U6.27(A1) U6.28(A2) U7.1(A3) U7.2(A4) U7.19(PWM15) U7.21(A5) U7.26(A0) U7.27(A1) U7.28(A2) U8.1(A3) U8.2(A4) U8.19(PWM15) U8.21(A5) U8.26(A0) U8.27(A1) U8.28(A2) U9.1(A3) U9.2(A4) U9.19(PWM15) U9.21(A5) U9.26(A0) U9.27(A1) U9.28(A2) U10.1(A3) U10.2(A4) U10.19(PWM15) U10.21(A5) U10.26(A0) U10.27(A1) U10.28(A2) U11.1(A3) U11.2(A4) U11.19(PWM15) U11.21(A5) U11.26(A0) U11.27(A1) U11.28(A2) U12.1(A3) U12.2(A4) U12.19(PWM15) U12.21(A5) U12.26(A0) U12.27(A1) U12.28(A2) U13.1(A3) U13.2(A4) U13.19(PWM15) U13.21(A5) U13.26(A0) U13.27(A1) U13.28(A2)

## Library data of the parts
LED1-LED64 = Semiconductors:ASMT_YTD7_0AA02
R1-R3 = passives:R
R4-R6 = resistor:R-EU_: RESISTOR, European symbol
U1 = Atmel_By_element14_Batch_1:ATMEGA644P-20AU: 8-bit Microcontroller with Bytes In-System Programmable Flash; MPN: ATMEGA644P-20AU; OC_FARNELL: 1455121; OC_NEWARK: 58M3746; PACKAGE: TQFP-44; SUPPLIER: Atmel
U2-U13 = microbuilder:PCA9685: PCA9685 - 16 Channel 12-Bit I2C PWM Controller 5.0V tolerant 16 channel, 12-bit I2C PWM controller with 25mA per output (max. 400mA total) Digikey: 568-5931-1-ND

## Board
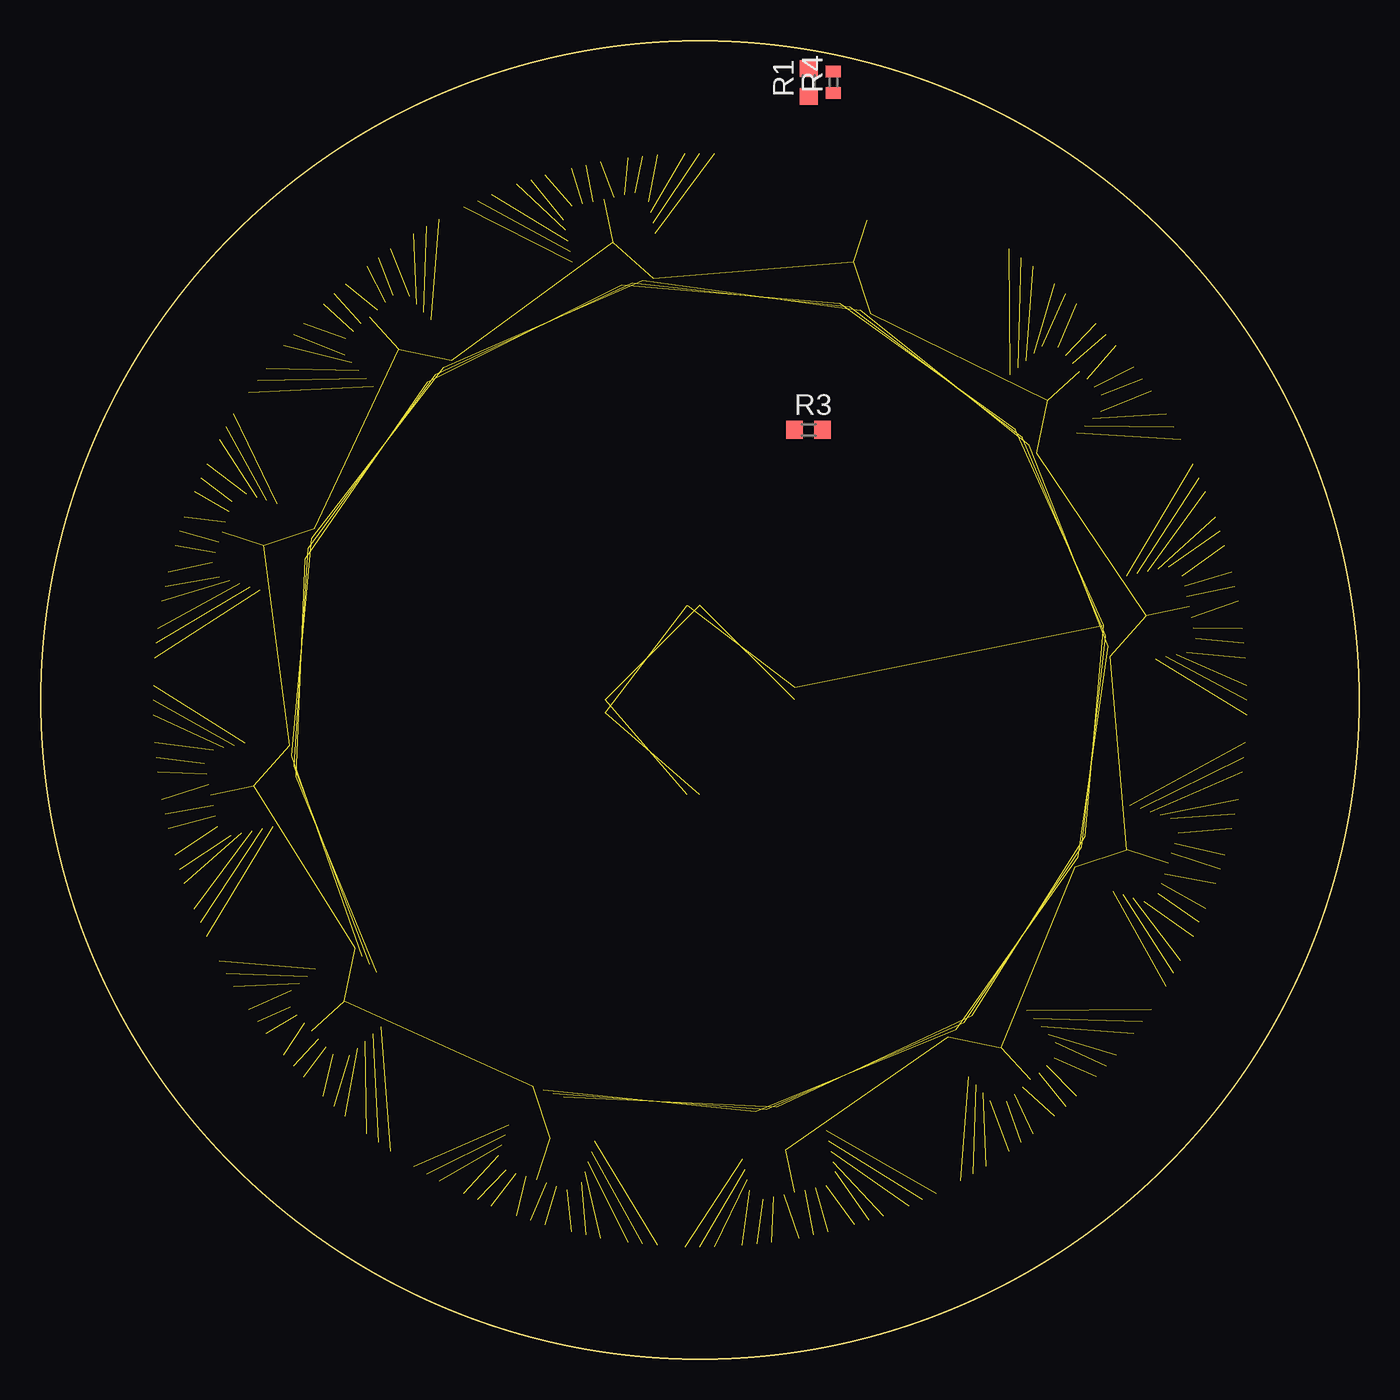
[diagram p5: board, top side]
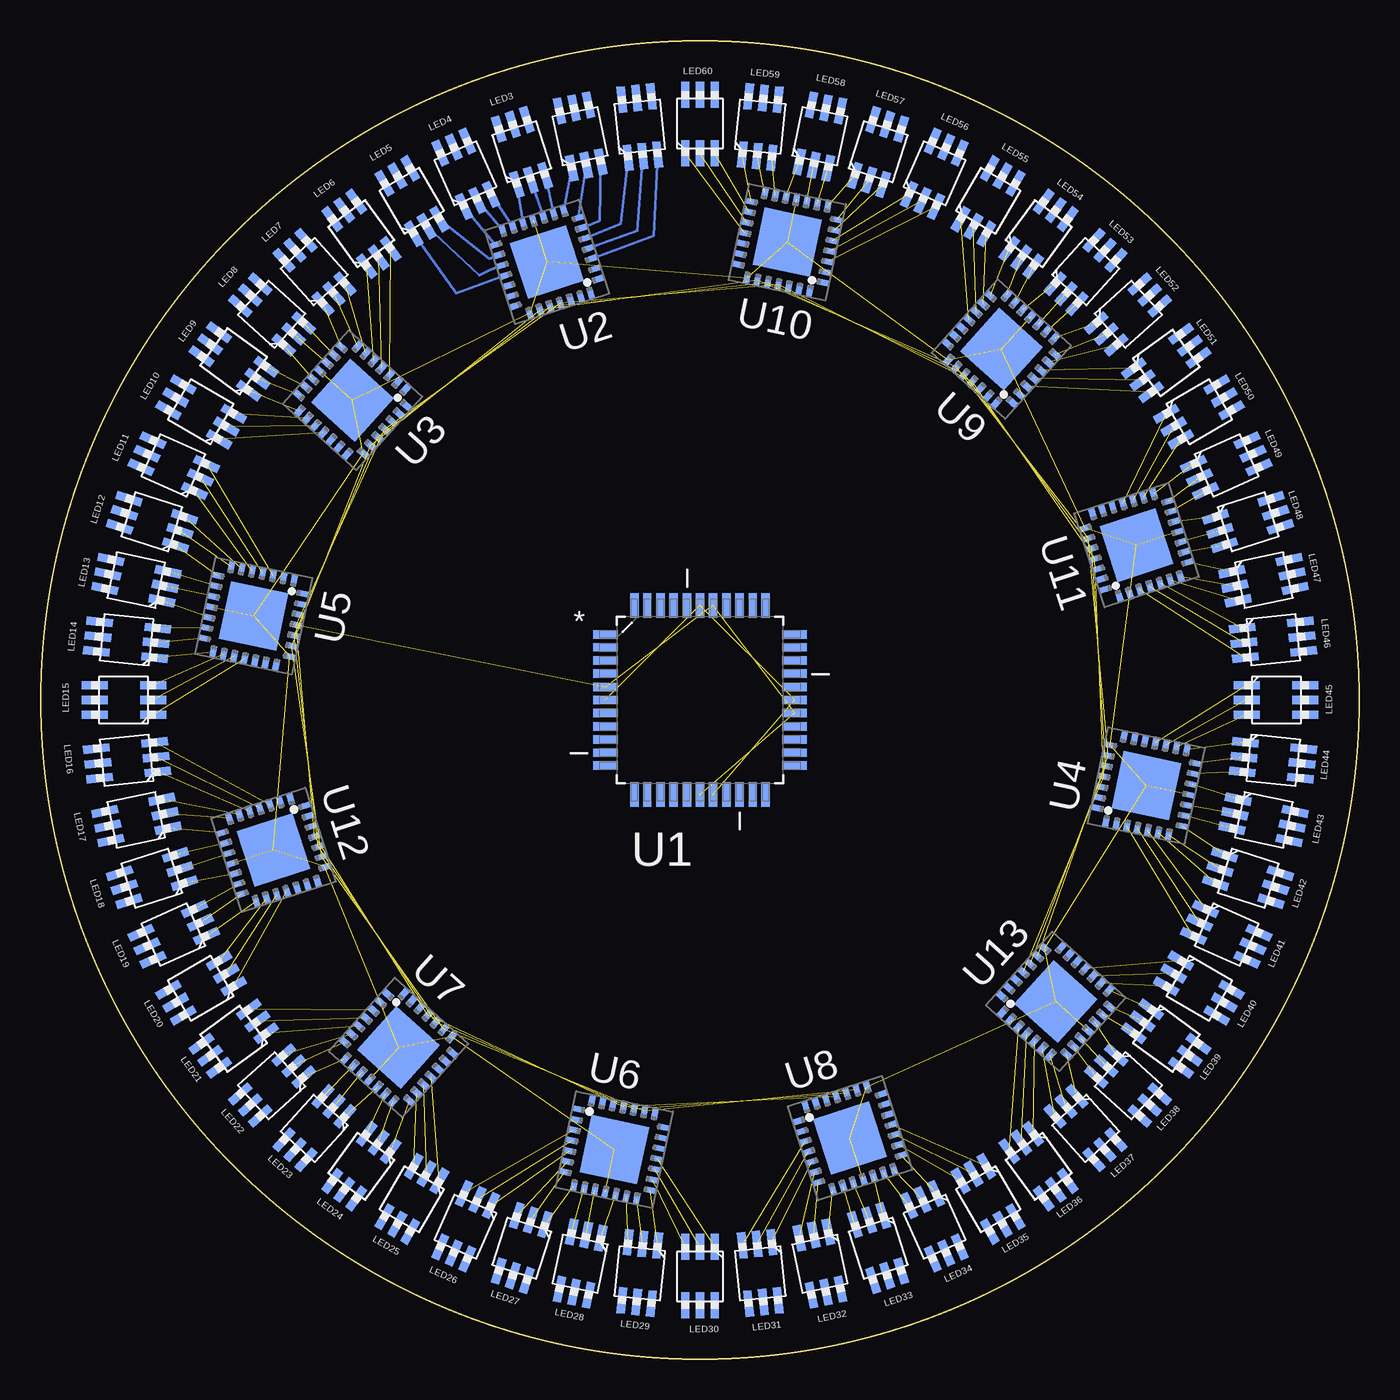
[diagram p6: board, bottom side, seen from below]

Size 80 x 80 mm. Coordinates in mm from the lower left corner, seen from the top.
Outline: circle at 40,40 radius 40
Copper layers (1*16): Top 0.035mm / dielectric 1.5mm / Bottom 0.035mm
Design rules "ITEADstudio_DRC": minimum track width 6mil, minimum drill 12mil, track to track 6mil, track to pad 6mil, pad to pad 6mil, via to via 6mil, smd to smd 0mil, copper to edge 10mil, drill to drill 10mil, minimum pad ring 10mil, minimum via ring 6mil, stop-mask expansion 2mil, vias tented up to drill 100mil, thermal gap 10mil

### Footprints (pad centres in the part's own frame; a part is rotated, then mirrored left to right if it is on the bottom)
ASMT-YTD7-0AA02 = smd 1.6 x 0.5: 1 1.8,-0.9; 2 1.8,0; 3 1.8,0.9; 4 -1.75,0.9; 5 -1.75,0; 6 -1.75,-0.9
R0603 = smd 1 x 1.1: 1 -0.85,0; 2 0.85,0
R0402 = smd 0.7 x 0.9: 1 -0.65,0; 2 0.65,0
QFP80P1200X1200X120-44N = smd 1.473 x 0.508: 1 -5.74,3.988; 2 -5.74,3.2; 3 -5.74,2.388; 4 -5.74,1.6; 5 -5.74,0.787; 6 -5.74,0; 7 -5.74,-0.787; 8 -5.74,-1.6; 9 -5.74,-2.388; 10 -5.74,-3.2; 11 -5.74,-3.988; 23 5.74,-3.988; 24 5.74,-3.2; 25 5.74,-2.388; 26 5.74,-1.6; 27 5.74,-0.787; 28 5.74,0; 29 5.74,0.787; 30 5.74,1.6; 31 5.74,2.388; 32 5.74,3.2; 33 5.74,3.988 | smd 0.508 x 1.473: 12 -3.988,-5.74; 13 -3.2,-5.74; 14 -2.388,-5.74; 15 -1.6,-5.74; 16 -0.787,-5.74; 17 0,-5.74; 18 0.787,-5.74; 19 1.6,-5.74; 20 2.388,-5.74; 21 3.2,-5.74; 22 3.988,-5.74; 34 3.988,5.74; 35 3.2,5.74; 36 2.388,5.74; 37 1.6,5.74; 38 0.787,5.74; 39 0,5.74; 40 -0.787,5.74; 41 -1.6,5.74; 42 -2.388,5.74; 43 -3.2,5.74; 44 -3.988,5.74
QFN28 = smd 0.8 x 0.4: 1 -2.65,1.95; 2 -2.65,1.3; 3 -2.65,0.65; 4 -2.65,0; 5 -2.65,-0.65; 6 -2.65,-1.3; 7 -2.65,-1.95; 15 2.65,-1.95; 16 2.65,-1.3; 17 2.65,-0.65; 18 2.65,0; 19 2.65,0.65; 20 2.65,1.3; 21 2.65,1.95 | smd 0.4 x 0.8: 8 -1.95,-2.65; 9 -1.3,-2.65; 10 -0.65,-2.65; 11 0,-2.65; 12 0.65,-2.65; 13 1.3,-2.65; 14 1.95,-2.65; 22 1.95,2.65; 23 1.3,2.65; 24 0.65,2.65; 25 0,2.65; 26 -0.65,2.65; 27 -1.3,2.65; 28 -1.95,2.65 | smd 3.55 x 3.55: M 0,0

### Placement (x,y rotation side)
LED1  43.66,74.81 276 bottom
LED2  47.28,74.24 282 bottom
LED3  50.82,73.29 288 bottom
LED4  54.24,71.97 294 bottom
LED5  57.5,70.31 300 bottom
LED6  60.57,68.32 306 bottom
LED7  63.42,66.01 312 bottom
LED8  66.01,63.42 318 bottom
LED9  68.32,60.57 324 bottom
LED10  70.31,57.5 330 bottom
LED11  71.97,54.24 336 bottom
LED12  73.29,50.82 342 bottom
LED13  74.24,47.28 348 bottom
LED14  74.81,43.66 354 bottom
LED15  75,40 0 bottom
LED16  74.81,36.34 6 bottom
LED17  74.24,32.72 12 bottom
LED18  73.29,29.18 18 bottom
LED19  71.97,25.76 24 bottom
LED20  70.31,22.5 30 bottom
LED21  68.32,19.43 36 bottom
LED22  66.01,16.58 42 bottom
LED23  63.42,13.99 48 bottom
LED24  60.57,11.68 54 bottom
LED25  57.5,9.69 60 bottom
LED26  54.24,8.03 66 bottom
LED27  50.82,6.71 72 bottom
LED28  47.28,5.76 78 bottom
LED29  43.66,5.19 84 bottom
LED30  40,5 90 bottom
LED31  36.34,5.19 96 bottom
LED32  32.72,5.76 102 bottom
LED33  29.18,6.71 108 bottom
LED34  25.76,8.03 114 bottom
LED35  22.5,9.69 120 bottom
LED36  19.43,11.68 126 bottom
LED37  16.58,13.99 132 bottom
LED38  13.99,16.58 138 bottom
LED39  11.68,19.43 144 bottom
LED40  9.69,22.5 150 bottom
LED41  8.03,25.76 156 bottom
LED42  6.71,29.18 162 bottom
LED43  5.76,32.72 168 bottom
LED44  5.19,36.34 174 bottom
LED45  5,40 180 bottom
LED46  5.19,43.66 186 bottom
LED47  5.76,47.28 192 bottom
LED48  6.71,50.82 198 bottom
LED49  8.03,54.24 204 bottom
LED50  9.69,57.5 210 bottom
LED51  11.68,60.47 216 bottom
LED52  13.99,63.42 222 bottom
LED53  16.58,66.01 228 bottom
LED54  19.43,68.32 234 bottom
LED55  22.5,70.31 240 bottom
LED56  25.76,71.97 246 bottom
LED57  29.18,73.29 252 bottom
LED58  32.72,74.24 258 bottom
LED59  36.34,74.81 264 bottom
LED60  40,75 270 bottom
LED61  3,-42 0 top  (outside the outline)
LED62  3,-46 0 top  (outside the outline)
LED63  3,-50 0 top  (outside the outline)
LED64  3,-54 0 top  (outside the outline)
R1  46.6,77.5 90 top
R2  1.5,-61.7 0 top  (outside the outline)
R3  46.6,56.4 0 top
R4  48.1,77.5 90 top
R5  1.5,-72.1 0 top  (outside the outline)
R6  1.5,-75.5 0 top  (outside the outline)
U1  40,40 0 bottom
U2  49.3,66.6 198 bottom
U3  61.1,58.2 228 bottom
U4  12.9,34.8 78 bottom
U5  67.1,45.1 258 bottom
U6  45.2,12.7 348 bottom
U7  58.3,18.9 318 bottom
U8  30.9,13.4 18 bottom
U9  21.7,61.3 138 bottom
U10  34.7,67.8 168 bottom
U11  13.5,49.4 108 bottom
U12  65.9,30.9 288 bottom
U13  18.4,21.7 48 bottom

### Tracks (layer width: path | path; a pad name or v marks a point on that pad's centre or on a via)
DGND  (34 unrouted)
GND  (3 unrouted)
N$2  (1 unrouted)
N$6
  Bottom 0.152: U2.9 LED3.3
N$7
  Bottom 0.152: U2.12 LED3.1
N$8
  Bottom 0.152: U2.8 LED2.1
N$9
  Bottom 0.152: U2.7 LED2.2
N$10
  Bottom 0.152: LED2.3 46.1,69.1 U2.6
N$11
  Bottom 0.152: LED1.1 44.8,68.9 U2.5
N$12
  Bottom 0.152: LED1.2 43.8,68.5 U2.4
N$13
  Bottom 0.152: LED1.3 42.8,68.2 U2.3
N$14
  Bottom 0.152: U2.13 LED4.3
N$15
  Bottom 0.152: U2.14 LED4.2
N$16
  Bottom 0.152: U2.15 LED4.1
N$17
  Bottom 0.152: U2.16 52.8,66.8 LED5.3
N$18
  Bottom 0.152: U2.17 52.8,66.1 53.4,65.8 LED5.2
N$19
  Bottom 0.152: LED5.1 54.8,64.7 U2.18
N$20
  Bottom 0.152: U2.10 LED3.2
N$21  (1 unrouted)
N$22  (1 unrouted)
N$23  (1 unrouted)
N$24  (1 unrouted)
N$25  (1 unrouted)
N$26  (1 unrouted)
N$27  (1 unrouted)
N$28  (1 unrouted)
N$29  (1 unrouted)
N$30  (1 unrouted)
N$31  (1 unrouted)
N$32  (1 unrouted)
N$33  (1 unrouted)
N$34  (1 unrouted)
N$35  (1 unrouted)
N$36  (1 unrouted)
N$37  (1 unrouted)
N$38  (1 unrouted)
N$39  (1 unrouted)
N$40  (1 unrouted)
N$41  (1 unrouted)
N$42  (1 unrouted)
N$43  (1 unrouted)
N$44  (1 unrouted)
N$45  (1 unrouted)
N$46  (1 unrouted)
N$47  (1 unrouted)
N$48  (1 unrouted)
N$49  (1 unrouted)
N$50  (1 unrouted)
N$51  (1 unrouted)
N$52  (1 unrouted)
N$53  (1 unrouted)
N$54  (1 unrouted)
N$55  (1 unrouted)
N$56  (1 unrouted)
N$57  (1 unrouted)
N$58  (1 unrouted)
N$59  (1 unrouted)
N$60  (1 unrouted)
N$61  (1 unrouted)
N$62  (1 unrouted)
N$63  (1 unrouted)
N$64  (1 unrouted)
N$65  (1 unrouted)
N$66  (1 unrouted)
N$67  (1 unrouted)
N$68  (1 unrouted)
N$69  (1 unrouted)
N$70  (1 unrouted)
N$71  (1 unrouted)
N$72  (1 unrouted)
N$73  (1 unrouted)
N$74  (1 unrouted)
N$75  (1 unrouted)
N$76  (1 unrouted)
N$77  (1 unrouted)
N$78  (1 unrouted)
N$79  (1 unrouted)
N$80  (1 unrouted)
N$81  (1 unrouted)
N$82  (1 unrouted)
N$83  (1 unrouted)
N$84  (1 unrouted)
N$85  (1 unrouted)
N$86  (1 unrouted)
N$87  (1 unrouted)
N$88  (1 unrouted)
N$89  (1 unrouted)
N$90  (1 unrouted)
N$91  (1 unrouted)
N$92  (1 unrouted)
N$93  (1 unrouted)
N$94  (1 unrouted)
N$95  (1 unrouted)
N$96  (1 unrouted)
N$97  (1 unrouted)
N$98  (1 unrouted)
N$99  (1 unrouted)
N$100  (1 unrouted)
N$101  (1 unrouted)
N$102  (1 unrouted)
N$103  (1 unrouted)
N$104  (1 unrouted)
N$105  (1 unrouted)
N$106  (1 unrouted)
N$107  (1 unrouted)
N$108  (1 unrouted)
N$109  (1 unrouted)
N$110  (1 unrouted)
N$111  (1 unrouted)
N$112  (1 unrouted)
N$113  (1 unrouted)
N$114  (1 unrouted)
N$115  (1 unrouted)
N$116  (1 unrouted)
N$117  (1 unrouted)
N$118  (1 unrouted)
N$119  (1 unrouted)
N$120  (1 unrouted)
N$121  (1 unrouted)
N$122  (1 unrouted)
N$123  (1 unrouted)
N$124  (1 unrouted)
N$125  (1 unrouted)
N$126  (1 unrouted)
N$127  (1 unrouted)
N$128  (1 unrouted)
N$129  (1 unrouted)
N$130  (1 unrouted)
N$131  (1 unrouted)
N$132  (1 unrouted)
N$133  (1 unrouted)
N$134  (1 unrouted)
N$135  (1 unrouted)
N$136  (1 unrouted)
N$137  (1 unrouted)
N$138  (1 unrouted)
N$139  (1 unrouted)
N$140  (1 unrouted)
N$141  (1 unrouted)
N$142  (1 unrouted)
N$143  (1 unrouted)
N$144  (1 unrouted)
N$145  (1 unrouted)
N$146  (1 unrouted)
N$147  (1 unrouted)
N$148  (1 unrouted)
N$149  (1 unrouted)
N$150  (1 unrouted)
N$151  (1 unrouted)
N$152  (1 unrouted)
N$153  (1 unrouted)
N$154  (1 unrouted)
N$155  (1 unrouted)
N$156  (1 unrouted)
N$157  (1 unrouted)
N$158  (1 unrouted)
N$159  (1 unrouted)
N$160  (1 unrouted)
N$161  (1 unrouted)
N$162  (1 unrouted)
N$163  (1 unrouted)
N$164  (1 unrouted)
N$165  (1 unrouted)
N$166  (1 unrouted)
N$167  (1 unrouted)
N$168  (1 unrouted)
N$169  (1 unrouted)
N$170  (1 unrouted)
N$171  (1 unrouted)
N$172  (1 unrouted)
N$173  (1 unrouted)
N$174  (1 unrouted)
N$175  (1 unrouted)
N$176  (1 unrouted)
N$177  (1 unrouted)
N$178  (1 unrouted)
N$179  (1 unrouted)
N$180  (1 unrouted)
N$181  (1 unrouted)
N$182  (1 unrouted)
N$183  (1 unrouted)
N$184  (1 unrouted)
SCL  (11 unrouted)
SDA  (11 unrouted)
VCC  (15 unrouted)